# Altium project RUT_LCD_SHIELD.PrjPcb
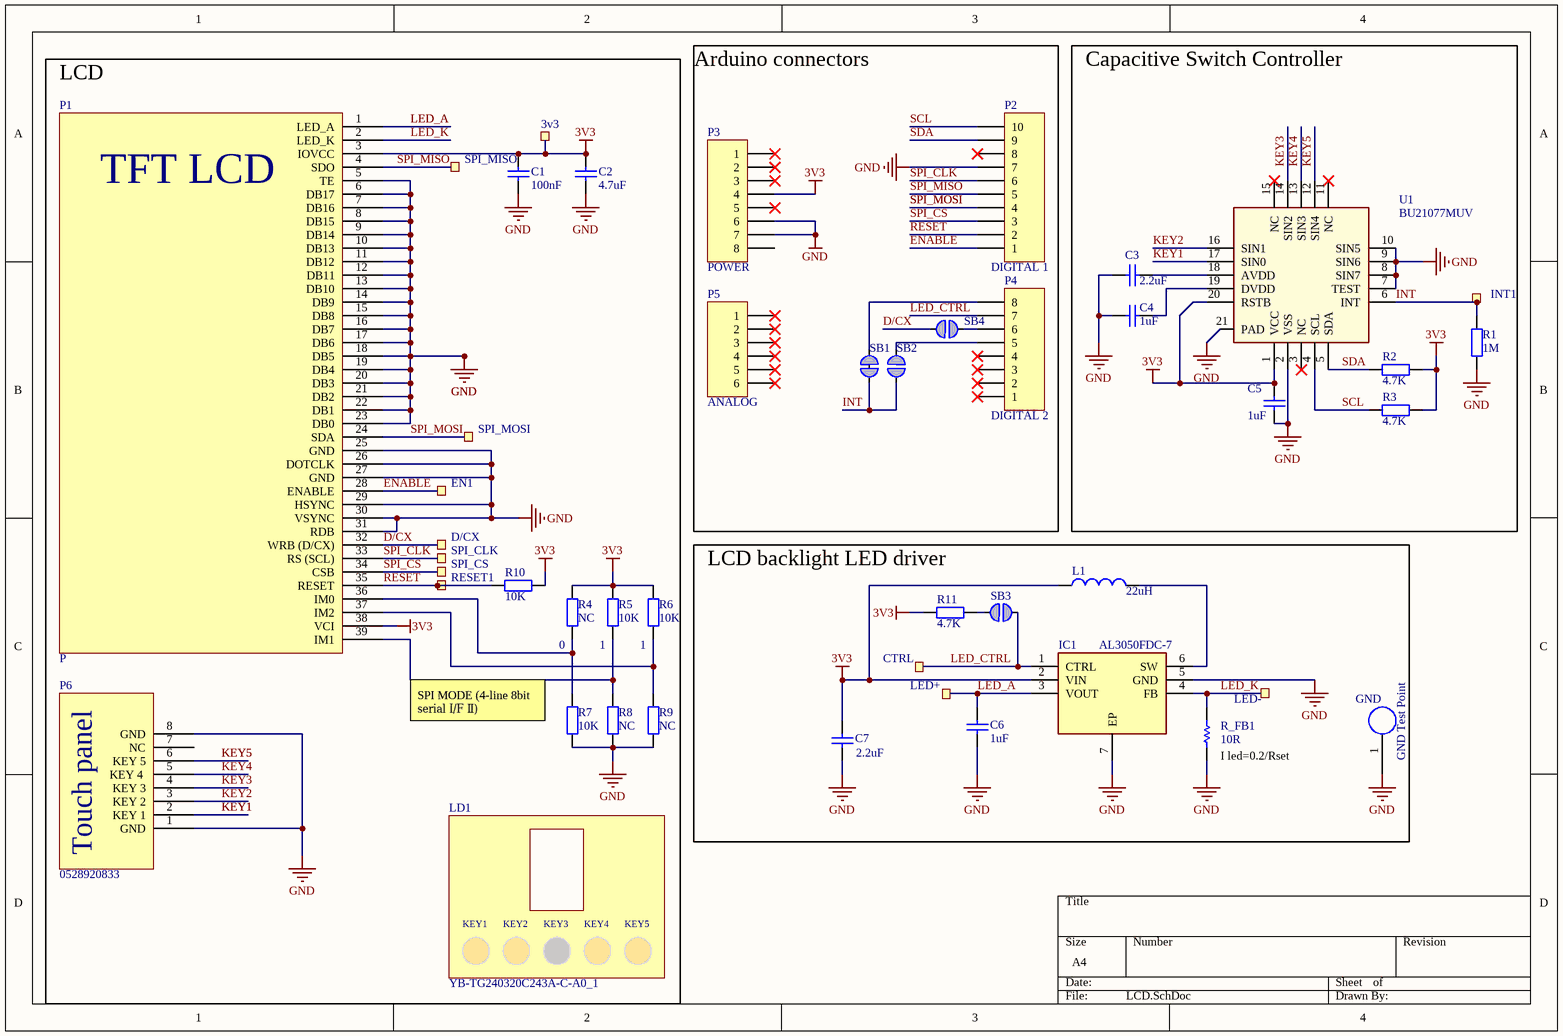
[diagram p0: LCD.SchDoc]
1 sheet, 46 parts. Net scope: global (net labels, ports and power ports of the same name join across sheets).
Board file: RUT_LCD_1.PcbDoc

## Sheet LCD.SchDoc
size A4; Revision: 1

### Parts
3v3  Test point  [TP_SMD_Ø1.0mm]  (value not drawn)  (no BOM)
C1  value 100nF  [c0402]  (hidden comment: Cap Semi)
C2  value 4.7uF  [c0402]  (hidden comment: Cap Semi)
C3  2.2uF  [C0402]
C4  1uF  [C0402]
C5  1uF  [C0402]
C6  value 1uF  [C0402]  (hidden comment: Cap Semi)
C7  value 2.2uF  [C0402]  (hidden comment: Cap Semi)
CTRL  Test point  [TP_SMD_Ø1.0mm]  (value not drawn)  (no BOM)
D/CX  Test point  [TP_SMD_Ø1.0mm]  (value not drawn)  (no BOM)
EN1  Test point  [TP_SMD_Ø1.0mm]  (value not drawn)  (no BOM)
GND  GND Test Point  [5019_keystone]
IC1  AL3050FDC-7  [SON65P200X200X61-7N]
INT1  Test point  [TP_SMD_Ø1.0mm]  (value not drawn)  (no BOM)
L1  value 22uH  [L2016X12N]
LD1  YB-TG240320C243A-C-A0_1  [LCD MODULE YB-TG240320C243A-C-A0]
LED+  Test point  [TP_SMD_Ø1.0mm]  (value not drawn)  (no BOM)
LED-  Test point  [TP_SMD_Ø1.0mm]  (value not drawn)  (no BOM)
P1  P  [FPC-39-0.3mm]
P2  DIGITAL 1  [Header  10way SMT 2.54mm 1row]
P3  POWER  [Header  8way SMT 2.54mm 1row]
P4  DIGITAL 2  [Header  8way SMT 2.54mm 1row]
P5  ANALOG  [Header  6way SMT 2.54mm 1row]
P6  0528920833  [CONN FFC BOTTOM 8POS 0.50MM]
R1  1M  [R0402]
R2  4.7K  [R0402]
R3  4.7K  [R0402]
R4  value NC  [R0402]  (hidden comment: Res2)
R5  value 10K  [R0402]  (hidden comment: Res2)  (no BOM)
R6  value 10K  [R0402]  (hidden comment: Res2)
R7  value 10K  [R0402]  (hidden comment: Res2)  (no BOM)
R8  value NC  [R0402]  (hidden comment: Res2)
R9  value NC  [R0402]  (hidden comment: Res2)  (no BOM)
R10  value 10K  [R0402]  (hidden comment: Res2)
R11  4.7K  [R0402]
R_FB1  value 10R  [R0402]  (hidden comment: Res1)
RESET1  Test point  [TP_SMD_Ø1.0mm]  (value not drawn)  (no BOM)
SB1  Solderbridge  [Solderbridge_Shorted]  (value not drawn)  (net tie, no BOM)
SB2  Solderbridge  [Solderbridge]  (value not drawn)  (no BOM)
SB3  Solderbridge  [Solderbridge]  (value not drawn)  (no BOM)
SB4  Solderbridge  [Solderbridge]  (value not drawn)  (no BOM)
SPI_CLK  Test point  [TP_SMD_Ø1.0mm]  (value not drawn)  (no BOM)
SPI_CS  Test point  [TP_SMD_Ø1.0mm]  (value not drawn)  (no BOM)
SPI_MISO  Test point  [TP_SMD_Ø1.0mm]  (value not drawn)  (no BOM)
SPI_MOSI  Test point  [TP_SMD_Ø1.0mm]  (value not drawn)  (no BOM)
U1  BU21077MUV  [VQFN020V4040 - 0.3mm holes]

### Blocks framed on the sheet
LCD: 3v3 C1 C2 D/CX EN1 LD1 P1 P6 R4-R10 RESET1 SPI_CLK SPI_CS SPI_MISO SPI_MOSI
Arduino connectors: P2-P5 SB1 SB2 SB4
Capacitive Switch Controller: C3-C5 INT1 R1-R3 U1
LCD backlight LED driver: C6 C7 CTRL GND IC1 L1 LED+ LED- R11 R_FB1 SB3

### Nets
3V3: 3v3.1 C1.2 C2.2 C5.2 C7.1 IC1.2(VIN) L1.1 P1.3(IOVCC) P1.38(VCI) P3.4 R2.2 R3.1 R4.1 R5.1 R6.1 R10.2 R11.1 U1.1(VCC) U1.20(RSTB)
GND: C1.1 C2.1 C3.1 C4.1 C5.1 C6.2 C7.2 GND.1 IC1.5(GND) IC1.7(EP) P1.5(TE) P1.6(DB17) P1.7(DB16) P1.8(DB15) P1.9(DB14) P1.10(DB13) P1.11(DB12) P1.12(DB11) P1.13(DB10) P1.14(DB9) P1.15(DB8) P1.16(DB7) P1.17(DB6) P1.18(DB5) P1.19(DB4) P1.20(DB3) P1.21(DB2) P1.22(DB1) P1.23(DB0) P1.25(GND) P1.26(DOTCLK) P1.27(GND) P1.29(HSYNC) P1.30(VSYNC) P1.31(RDB) P2.7 P3.6 P3.7 P6.1(GND) P6.8(GND) R1.1 R7.2 R8.2 R9.1 R_FB1.1 U1.2(VSS) U1.7(TEST) U1.8(SIN7) U1.9(SIN6) U1.10(SIN5) U1.21(PAD)
D/CX: D/CX.1 P1.32(WRB_(D/CX)) SB4.1
ENABLE: EN1.1 P1.28(ENABLE) P2.1
INT: INT1.1 R1.2 SB1.2 SB2.2 U1.6(INT)
KEY1: P6.2(KEY_1) U1.17(SIN0)
KEY2: P6.3(KEY_2) U1.16(SIN1)
KEY3: P6.4(KEY_3) U1.14(SIN2)
KEY4: P6.5(KEY_4) U1.13(SIN3)
KEY5: P6.6(KEY_5) U1.12(SIN4)
LED_A: C6.1 IC1.3(VOUT) LED+.1 P1.1(LED_A)
LED_CTRL: CTRL.1 IC1.1(CTRL) P4.7 SB3.2
LED_K: IC1.4(FB) LED-.1 P1.2(LED_K) R_FB1.2
RESET: P1.35(RESET) P2.2 R10.1 RESET1.1
SCL: P2.10 R3.2 U1.4(SCL)
SDA: P2.9 R2.1 U1.5(SDA)
SPI_CLK: P1.33(RS_(SCL)) P2.6 SPI_CLK.1
SPI_CS: P1.34(CSB) P2.3 SPI_CS.1
SPI_MISO: P1.4(SDO) P2.5 SPI_MISO.1
SPI_MOSI: P1.24(SDA) P2.4 SPI_MOSI.1
NetC3_2: C3.2 U1.18(AVDD)
NetC4_2: C4.2 U1.19(DVDD)
NetIC1_6: IC1.6(SW) L1.2
NetP1_36: P1.36(IM0) R4.2 R7.1
NetP1_37: P1.37(IM2) R6.2 R9.2
NetP1_39: P1.39(IM1) R5.2 R8.1
NetP4_5: P4.5 SB2.1
NetP4_6: P4.6 SB4.2
NetP4_8: P4.8 SB1.1
NetR11_2: R11.2 SB3.1

Not connected (* = marked no-connect by the designer): P2 8*; P3 1* 2* 3* 5* 8; P4 1* 2* 3* 4*; P5 1* 2* 3* 4* 5* 6*; P6 7(NC); U1 3(NC)* 11(NC)* 15(NC)*

### Notes on the sheet
- (near R4) 0
- (near R5) 1
- (near R6) 1
- (near R7) SPI MODE (4-line 8bit serial I/F Ⅱ)
- (near R_FB1) I led=0.2/Rset
- (in symbol 0528920833) Touch panel
- (in symbol P) TFT LCD
- (in symbol YB-TG240320C243A-C-A0_1) KEY1; KEY2; KEY3; KEY4; KEY5

### Library data of the parts
3v3 CTRL D/CX EN1 INT1 LED+ LED- RESET1 SPI_CLK SPI_CS SPI_MISO SPI_MOSI = TP_SMD_Ø1.0MM: 1.0mm circular SMD testpad; Value: Test point
C1 = Cap Semi: Capacitor (Semiconductor SIM Model); Manufacturer: YAGEO; Manufacturer Part No.: CC0402KRX7R9BB104; Part Description: Ceramic Capacitor; Specification: X7R, 50V, 10%; Supplier: Rutronik; Supplier part number: KKK23619; Link: https://www.rutronik24.com/search-result/qs:KKK23619/reset:0
C2 = Cap Semi: Capacitor (Semiconductor SIM Model); Manufacturer: Samsung; Manufacturer Part No.: CL05A475KP5NRNC; Part Description: Ceramic Capacitor; Specification: X5R, 10V, 10%; Supplier: Rutronik; Supplier part number: KKS2214; Link: https://www.rutronik24.com/product/samsung+em/cl05a475kp5nrnc/32126.html
C3 C7 = Cap Semi: Capacitor (Semiconductor SIM Model); Manufacturer: muRata; Manufacturer Part No.: GRM155R61A225KE01D; Part Description: Ceramic Capacitor; Specification: X5R, 10V, 10%; Supplier: Rutronik; Supplier part number: KKH1032; Link: https://www.rutronik24.com/product/murata/grm155r61a225ke01d/12952430.html
  C3: Value: 2.2uF
C4-C6 = Cap Semi: Capacitor (Semiconductor SIM Model); Manufacturer: muRata; Manufacturer Part No.: GRM155R61E105KA12D; Part Description: Ceramic Capacitor; Specification: X5R, 25V, 10%; Supplier: Rutronik; Supplier part number: KKS4987; Link: https://www.rutronik24.com/product/murata/grm155r61e105ka12d/4725132.html
  C4 C5: Value: 1uF
GND = 5019: SMD Test Point; Manufacturer: Keystone Electrincs; Part Description: SMT Test Point; Specification: 3.81*2.03; Value: 5019; Manufacturer Part No.: 5019; Supplier: Rutronik; Supplier part number: BAT4950; Link: https://www.rutronik24.com/product/keystone/pn5019/7028403.html
IC1 = AL3050FDC-7: Integrated Circuit; Manufacturer: Diodes Inc.; Part Description: driver Step-up; Specification: 2.7-5.5 to 30V 40mA; Datasheet Link: https://www.diodes.com/search/?q=AL3050&t=keyword&action_results=Go; Link: https://www.rutronik24.com/search-result/qs:AL3050FDC-7/reset:0; Manufacturer Part No.: AL3050FDC-7; Supplier: Rutronik; Supplier part number: LEDDRV1525; Value: AL3050FDC-7
L1 = Inductor: Manufacturer: Chilisin Electronics; Manufacturer Part No.: BWVC00201612220M00; Specification: 2x1.6x1.2mm Irms 0.36A; Link: https://www.rutronik24.com/search-result/qs:BWVC00201612220M00/reset:0; Part Description: Inductor; Supplier: Rutronik
LD1 = YB-TG240320C243A-C-A0_1: Manufacturer: YEEBO GROUP; Part Description: MODULE ASSEMBLY; Specification: LCD with capacitive touch keys; Link: https://www.rutronik24.com/index.php?m=oc&action=nothingfound&qs=YB-TG240320C243A; Manufacturer Part No.: YB-TG240320C243A-C-A0_1; Supplier: Rutronik; Value: YB-TG240320C243A-C-A0_1
P1 = P: FPC CONNECTOR OF LCD MODULE; Manufacturer: Molex; Manufacturer Part No.: 5035663902; Part Description: FPC Connector, 0.30mm Pitch, Right-Angle, Bottom Contact, 0.95mm Height, 39 Circuits, Gold over Nickel Plating; Specification: SMT, 0,3mm pitch 39 circuits; Value: 5035663902; Link: https://www.rutronik24.com/search-result/qs:5035663902/reset:0; Supplier: Rutronik; Supplier part number: 5035663902
P2 = Header 10: Manufacturer: Amphenol ICC; Manufacturer Part No.: 10129380-910002ALF; Part Description: SMT Header; Specification: 10 pos. 2,54mm; Value: 10129380-910002ALF; Supplier: Rutronik; Supplier part number: 10129380910002ALF; Link: https://www.rutronik24.com/search-result/qs:10129380-910002ALF/reset:0
P3 P4 = Header 8: Manufacturer: Amphenol ICC; Manufacturer Part No.: 10129380-908002ALF; Part Description: SMT Header; Specification: 8 pos. 2,54mm; Value: 10129380-908002ALF; Supplier: Rutronik; Supplier part number: 10129380908002ALF; Link: https://www.rutronik24.com/search-result/qs:10129380-908002ALF/reset:0
P5 = Header 6: Manufacturer: Amphenol ICC; Manufacturer Part No.: 10129380-906002BLF; Part Description: SMT Header; Specification: 6 pos. 2,54mm; Value: 10129380-906002BLF; Supplier: Rutronik; Supplier part number: 10129380908002ALF; Link: https://www.rutronik24.com/search-result/qs:10129380-906002BLF/reset:0
P6 = 0528920833: CONN FFC BOTTOM 8POS 0.50MM R/A; Manufacturer: Molex; Specification: SMT, 0,5mm 8 circuits bottom right angle; Manufacturer Part No.: 0528920833
R1 = Res2: Manufacturer: ASJ; Manufacturer Part No.: CR10-105-JK; Part Description: Thick Film Resistor; Specification: 5% 0,063W; Value: 1M; Supplier: Rutronik; Supplier part number: WRC35254; Link: https://www.rutronik24.com/product/asj/cr10-105-jk/51971.html
R2 R3 R11 = Res2: Manufacturer: ASJ; Manufacturer Part No.: CR10-472-JK; Part Description: Thick Film Resistor; Specification: 5% 0,063W; Value: 4.7K; Supplier: Rutronik; Link: https://www.rutronik24.com/product/asj/cr10-472-jk/54393.html
  R2 R3: Supplier part number: WRC41427
  R11: Supplier part number: WRC40976
R4 R6 R8 R10 = Res2: Manufacturer: ASJ; Manufacturer Part No.: CR10-103-JK; Part Description: Thick Film Resistor; Specification: 5% 0,063W; Supplier: Rutronik; Supplier part number: WRC40976; Link: https://www.rutronik24.com/product/asj/cr10-103-jk/54295.html
R5 R7 R9 = Res2: Part Description: Not mounted
  R7 R9: Supplier part number: WRC40976
R_FB1 = Res1: Resistor; Part Description: Thick Film Resistor; Manufacturer: ASJ; Manufacturer Part No.: CR10-10R0-FK; Specification: 1% 0,063W; Link: https://www.rutronik24.com/product/asj/cr10-10r0-fk/52610.html; Supplier: Rutronik; Supplier part number: WRC36380
SB1 = Solderbridge Shorted: Shorted Solderbridge; Manufacturer: *; Value: Solderbridge
U1 = BU21077MUV: Capacitive Switch Controller IC; Manufacturer: Rohm; Manufacturer Part No.: BU21077MUV-E2; Specification: 8-CH I2C 2.7-5.5V; Value: BU21077MUV-E2; Link: https://www.rutronik24.com/search-result/qs:BU21077MUV/reset:0; Part Description: Capacitive Switch Controller; Supplier: Rutronik; Supplier part number: BU21077MUV-E2
SB2-SB4 = Solderbridge: Manufacturer: *; Value: Solderbridge